# Altium project Battery Profiler.PrjPcb
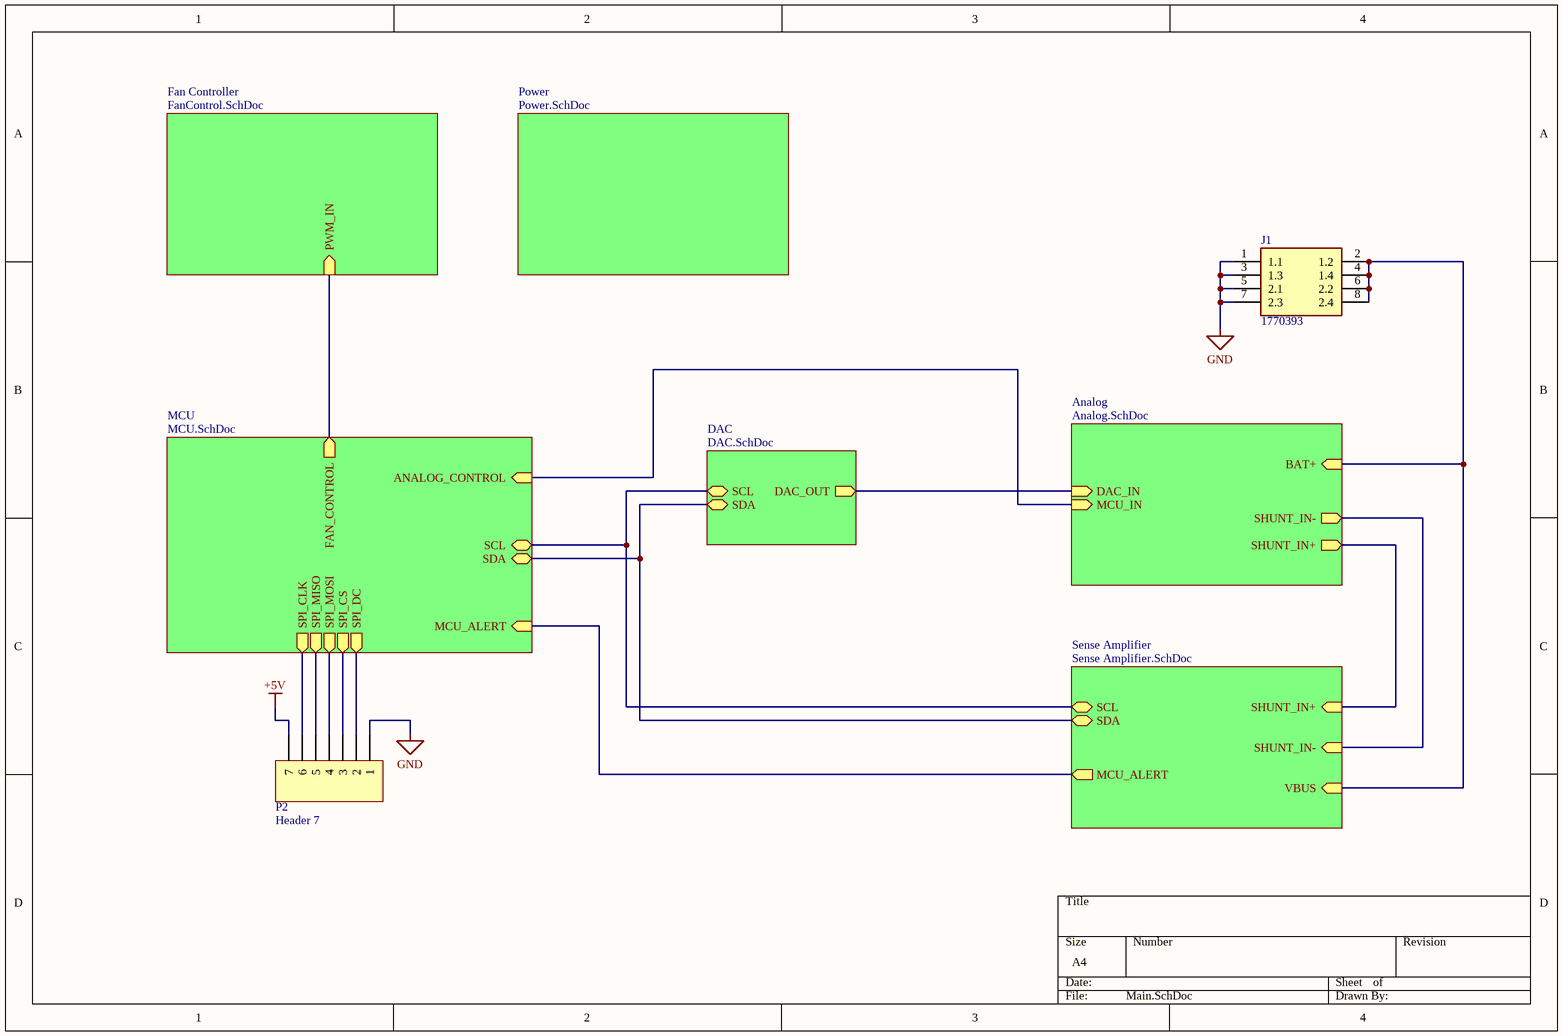
[diagram p0: Main.SchDoc]
7 sheets, 74 parts. Net scope: hierarchical (ports join the sheet entries above them; power ports are global).
Board file: PCB1.PcbDoc
Sheets:
  Main.SchDoc
    Analog = Analog.SchDoc
    MCU = MCU.SchDoc
    DAC = DAC.SchDoc
    Fan Controller = FanControl.SchDoc
    Power = Power.SchDoc
    Sense Amplifier = Sense Amplifier.SchDoc

## Sheet Main.SchDoc
size A4; SheetNumber: 1; SheetTotal: 7

### Parts
J1  1770393  [1770393]
P2  Header 7  [HDR1X7]

### Sub-sheets
Analog = Analog.SchDoc: DAC_IN (in), BAT+ (in), MCU_IN (in), SHUNT_IN+ (out), SHUNT_IN- (out)
DAC = DAC.SchDoc: DAC_OUT (out), SCL (bidir), SDA (bidir)
Fan Controller = FanControl.SchDoc: PWM_IN (in)
MCU = MCU.SchDoc: SPI_CLK (out), SPI_MISO (out), SPI_MOSI (out), SPI_CS (out), SPI_DC (out), FAN_CONTROL (out), SCL (bidir), SDA (bidir), MCU_ALERT (in), ANALOG_CONTROL (in)
Power = Power.SchDoc: no entries
Sense Amplifier = Sense Amplifier.SchDoc: SHUNT_IN+ (in), SHUNT_IN- (in), SCL (bidir), SDA (bidir), MCU_ALERT (out), VBUS (in)

### Nets
+5V: P2.7
GND: J1.1(1.1) J1.3(1.3) J1.5(2.1) J1.7(2.3) P2.1 ; sheet Analog/SHUNT_IN-, sheet Sense Amplifier/SHUNT_IN-
NetIC1_5: sheet MCU/FAN_CONTROL, sheet Fan Controller/PWM_IN
NetJ1_2: J1.2(1.2) J1.4(1.4) J1.6(2.2) J1.8(2.4) ; sheet Analog/BAT+, sheet Sense Amplifier/VBUS
NetP2_2: P2.2 ; sheet MCU/SPI_DC
NetP2_3: P2.3 ; sheet MCU/SPI_CS
NetP2_4: P2.4 ; sheet MCU/SPI_MOSI
NetP2_5: P2.5 ; sheet MCU/SPI_MISO
NetP2_6: P2.6 ; sheet MCU/SPI_CLK
NetQ3_3: sheet Analog/SHUNT_IN+, sheet Sense Amplifier/SHUNT_IN+
NetR2_1: sheet Analog/DAC_IN, sheet DAC/DAC_OUT
NetR16_2: sheet Analog/MCU_IN, sheet MCU/ANALOG_CONTROL
NetR25_1: sheet MCU/MCU_ALERT, sheet Sense Amplifier/MCU_ALERT
NetU3_27: sheet MCU/SDA, sheet DAC/SDA, sheet Sense Amplifier/SDA
NetU3_28: sheet MCU/SCL, sheet DAC/SCL, sheet Sense Amplifier/SCL

### Library data of the parts
J1 = 1770393: Connector; Manufacturer_Name: Phoenix Contact; Datasheet Link: https://www.phoenixcontact.com/online/portal/us/pxc/product_detail_page/!ut/p/z1/3Vdbb9owFP4r9IFHYzsXJ5m0B6BoQCkLJawkL1HsGOQ1tyYBOn79HC7dQBs8VGhaoiPFds75zsX-rBzowTn0kmAtlkEp0iSI5Nz1iO90nF7PVgj-OtE7aHCvd3sj7Qn3xwr8Bj3olQGFLq5GkaB5kP-A7qrgSbWQiVB-MgykWmo1Tx; Height: 29.2mm; Manufacturer_Part_Number: 1770393; Mouser Part Number: 651-1770393; Mouser Price/Stock: https://www.mouser.co.uk/ProductDetail/Phoenix-Contact/1770393?qs=MfVUZiz0PxY16TK7qzndTA%3D%3D; Arrow Part Number: 1770393; Arrow Price/Stock: https://www.arrow.com/en/products/1770393/phoenix-contact
P2 = Header 7: Header, 7-Pin; LatestRevisionDate: 17-Jul-2002; LatestRevisionNote: Re-released for DXP Platform.; Publisher: Altium Limited

## Sheet Analog.SchDoc
size A4; SheetNumber: 2; SheetTotal: 7
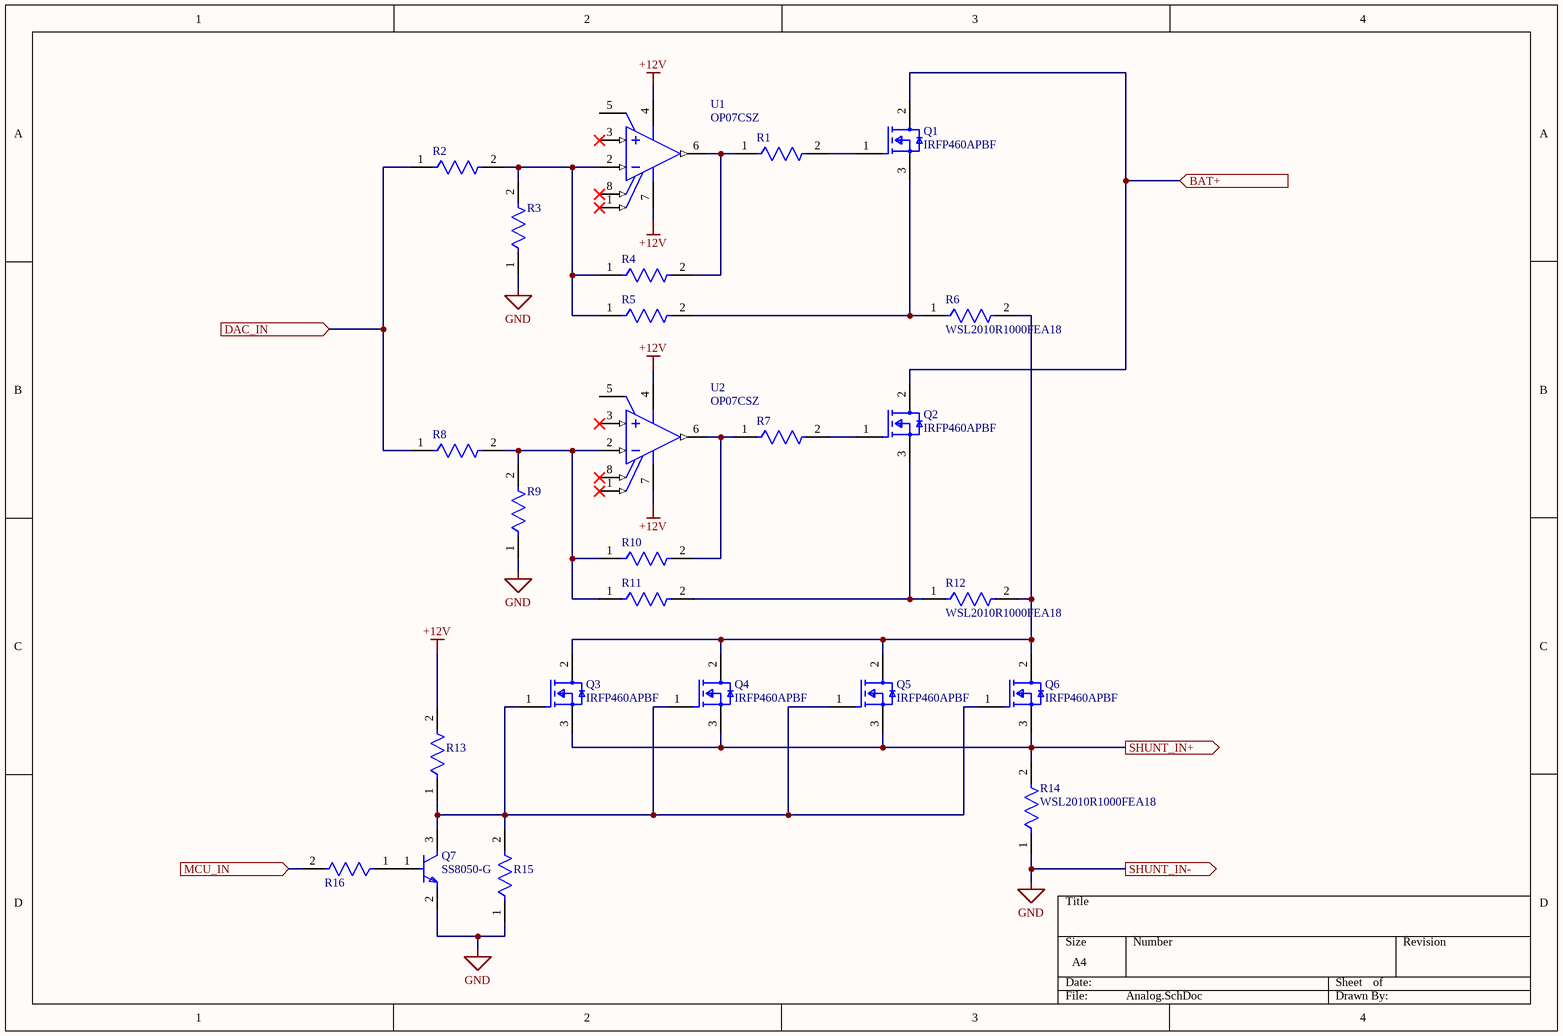
[diagram p1: Analog.SchDoc]

### Parts
Q1  IRFP460APBF  [FP-X13-0103-MFG]
Q2  IRFP460APBF  [FP-X13-0103-MFG]
Q3  IRFP460APBF  [FP-X13-0103-MFG]
Q4  IRFP460APBF  [FP-X13-0103-MFG]
Q5  IRFP460APBF  [FP-X13-0103-MFG]
Q6  IRFP460APBF  [FP-X13-0103-MFG]
Q7  SS8050-G  [FP-SS8050-G-MFG]
R1  ERJ-P06F1002V  [FP-ERJP06-MFG]  (value not drawn)
R2  ERJ-P06F1002V  [FP-ERJP06-MFG]  (value not drawn)
R3  ERJ-P06F1002V  [FP-ERJP06-MFG]  (value not drawn)
R4  ERJ-P06F1002V  [FP-ERJP06-MFG]  (value not drawn)
R5  ERJ-P06F1002V  [FP-ERJP06-MFG]  (value not drawn)
R6  WSL2010R1000FEA18  [FP-WSL2010-0_508-IPC_A]
R7  ERJ-P06F1002V  [FP-ERJP06-MFG]  (value not drawn)
R8  ERJ-P06F1002V  [FP-ERJP06-MFG]  (value not drawn)
R9  ERJ-P06F1002V  [FP-ERJP06-MFG]  (value not drawn)
R10  ERJ-P06F1002V  [FP-ERJP06-MFG]  (value not drawn)
R11  ERJ-P06F1002V  [FP-ERJP06-MFG]  (value not drawn)
R12  WSL2010R1000FEA18  [FP-WSL2010-0_508-IPC_A]
R13  ERJ-P06F1002V  [FP-ERJP06-MFG]  (value not drawn)
R14  WSL2010R1000FEA18  [FP-WSL2010-0_508-IPC_A]
R15  ERJ-P06F1002V  [FP-ERJP06-MFG]  (value not drawn)
R16  ERJ-P06F1002V  [FP-ERJP06-MFG]  (value not drawn)
U1  OP07CSZ  [ADI-R-8_M]
U2  OP07CSZ  [ADI-R-8_M]

### Ports
BAT+ (in, see Main[4B]), DAC_IN (in, see Main[3B]), MCU_IN (in, see Main[3B]), SHUNT_IN+ (out, see Main[4C], Sense Amplifier[1C]), SHUNT_IN- (out, see Main[4C], Sense Amplifier[1C])

### Nets
+12V: R13.2 U1.4(-V) U1.7(+V) U2.4(-V) U2.7(+V)
GND: Q7.2(E) R3.1 R9.1 R14.1 R15.1 ; port SHUNT_IN-
NetJ1_2: Q1.2(D) Q2.2(D) ; port BAT+
NetQ1_1: Q1.1(G) R1.2
NetQ1_3: Q1.3(S) R5.2 R6.1
NetQ2_1: Q2.1(G) R7.2
NetQ2_3: Q2.3(S) R11.2 R12.1
NetQ3_1: Q3.1(G) Q4.1(G) Q5.1(G) Q6.1(G) Q7.3(C) R13.1 R15.2
NetQ3_2: Q3.2(D) Q4.2(D) Q5.2(D) Q6.2(D) R6.2 R12.2
NetQ3_3: Q3.3(S) Q4.3(S) Q5.3(S) Q6.3(S) R14.2 ; port SHUNT_IN+
NetQ7_1: Q7.1(B) R16.1
NetR1_1: R1.1 R4.2 U1.6(OUT)
NetR2_1: R2.1 R8.1 ; port DAC_IN
NetR2_2: R2.2 R3.2 R4.1 R5.1 U1.2(-IN)
NetR7_1: R7.1 R10.2 U2.6(OUT)
NetR8_2: R8.2 R9.2 R10.1 R11.1 U2.2(-IN)
NetR16_2: R16.2 ; port MCU_IN

Not connected (* = marked no-connect by the designer): U1 1(VOS_TRIM)* 3(+IN)* 5(NC) 8(VOS_TRIM)*; U2 1(VOS_TRIM)* 3(+IN)* 5(NC) 8(VOS_TRIM)*

### Library data of the parts
Q1-Q6 = CMP-02550-000181-1: MOSFET N-CH 500V 20A TO-247AC; Manufacturer: Vishay; Max Junction Temp: +150°C; Depletion Mode: False; Number Of N Channels: 1; Drain To Source Resistance: 0.27Ω; Input Capacitace At Vds: 3100pF @ 25V; Pulse Drain Current: 80A; Turn Off Delay Time: 45ns; Reverse Recovery Charge: 5000nC; Turn On Delay Time: 18ns; Reverse Recovery Time: 480ns; Gate Charge At Vgs: 105nC @ 10V; Rthja Max: 40°C/W; Threshold Vgs Max: 4V; Max Forward Diode Voltage: 1.8V; Standoff Height: 3.71mm; Gate To Source Voltage: 30V; Power Dissipation: 280W; Threshold Vgs Min: 2V; RoHS: TRUE; Package: X13-0103; Temperature: -55°C to +150°C; ComponentLink2Description: Datasheet; Device Class L1: Discrete Semiconductors; Temperature Range High: +150°C; ComponentLink2URL: http://www.vishay.com/docs/91234/sihfp460.pdf; Height: 25.11mm; Manufacturer Part Number: IRFP460APBF; Automotive: No; Device Class L2: Transistors; Continuous Drain Current: 20A; Octopart: https://octopart.com/irfp460apbf-vishay-46526673; Temperature Range Low: -55°C; Number Of Channels: 1; Drain To Source Breakdown Voltage: 500V; Mouser Description: MOSFET N-Chan 500V 20 Amp; Category: Trans; Drain To Source Voltage: 500V; Lead Free: Yes; Device Class L3: MOSFETs; Digikey Description: MOSFET N-CH 500V 20A TO-247AC
Q7 = CMP-20235-000001-1: NPN TRANSISTOR 1.5A 40V SOT-23 R; Transition Frequency: 100MHz; Max Breakdown Voltage: 25V; Collector Emitter Voltage (VCEO): 400mV; Max Power Dissipation: 300mW; Max Collector Current: 1.5A; Case/Package: TO-236-3; Packaging: Tape and Reel; RoHS Compliant: Yes; Mount: Surface Mount; Collector Emitter Breakdown Voltage: 25V
R1-R5 R7-R11 R13 R15 R16 = CMP-05422-000126-1: RES SMD 10K OHM 1% 1/2W 0805; Temperature Coefficient: 100ppm/°C; Resistance: 10kR; Voltage Rating (DC): 150V; Max Power Dissipation: 500mW; Termination: SMD/SMT; Tolerance: 1%; Width: 1.2mm; Case/Package: 0805; Number of Terminations: 2; Resistor Type: Thick Film; Radiation Hardening: No; Resistance Tolerance: 1%; Package Quantity: 5000; Max Operating Temperature: 155°C; RoHS Compliant: Yes; Mount: Surface Mount; Case Code (Imperial): 0805; Construction: Rectangular; Height: 0.6mm; Lead Free: Lead Free; Depth: 1.25mm; Packaging: Tape and Reel; REACH SVHC: No SVHC; Technology: THICK FILM; Features: Automotive AEC-Q200; Contact Plating: Tin; Voltage Rating: 150V; Military Standard: Not; Power Rating: 500mW; Case Code (Metric): 2012; Length: 2mm; Min Operating Temperature: -55°C; Series: ERJ
R6 R12 R14 = CMP-00030-39744249-1: WSL2010R1000FEA18 SMD Chip Resistor, 100 MOhm, ± 1%, 1 W, 2010 [5025 Metric], Metal Strip, High Power; Resistance: 100mΩ; Power Rating: 1W; Temperature Coefficient: 75ppm/°C; Packaging: Cut Tape; Schedule B: 8533210045, 8533210045; Contact Plating: Tin; Height: 635µm; Max Operating Temperature: 170°C; Lead Free: Lead Free; RoHS: Compliant; Width: 2.5mm; Composition: Metal Element, Metal Strip; Radiation Hardening: No; Termination: SMD/SMT; Depth: 2.54mm; Length: 5mm; Case Code (Imperial): 2010; Case Code (Metric): 5025; Case/Package: 2010; Weight: 38.895546mg; REACH SVHC: Unknown; NexarPartId: 39744249; Tolerance: 1%; Min Operating Temperature: -65°C; Number of Pins: 2
U1 U2 = CMP-0384-01158-1: Single Channel Low Noise Operational Amplifier, 600 KHz BW, 300 mV/us SR, Industrial, 8-pin SOIC (R-8), Tube; Manufacturer: Analog Devices; Generic Part Number: OP07; # OpAmps per Pkg: 1; V Span Max: 44V; V Span Min: 6V; Small Signal Bandwidth: 600KHz; PackageReference: R-8; Packing: Tube; ComponentLink3Description: Package Specification; PartNumber: OP07CSZ; Code_JEDEC: MS-012-AA; ComponentLink2Description: Datasheet; DatasheetVersion: Rev. G; ComponentLink3URL: http://www.analog.com/static/imported-files/packages/PKG_PDF/SOIC_Narrow%20(R)/R_8.pdf; ComponentLink2URL: http://www.analog.com/static/imported-files/data_sheets/OP07.pdf; Slew Rate: 300mV/us; PackageDescription: 8-Pin Standard Small Outline Package, Body 3.9 x 4.9 mm, Pitch 1.27 mm; ComponentLink1URL: http://www.analog.com/en/index.html; Mounting Technology: Surface Mount; ComponentLink1Description: Manufacturer URL; PackageVersion: 060506-A

## Sheet MCU.SchDoc
size A; SheetNumber: 4; SheetTotal: 7
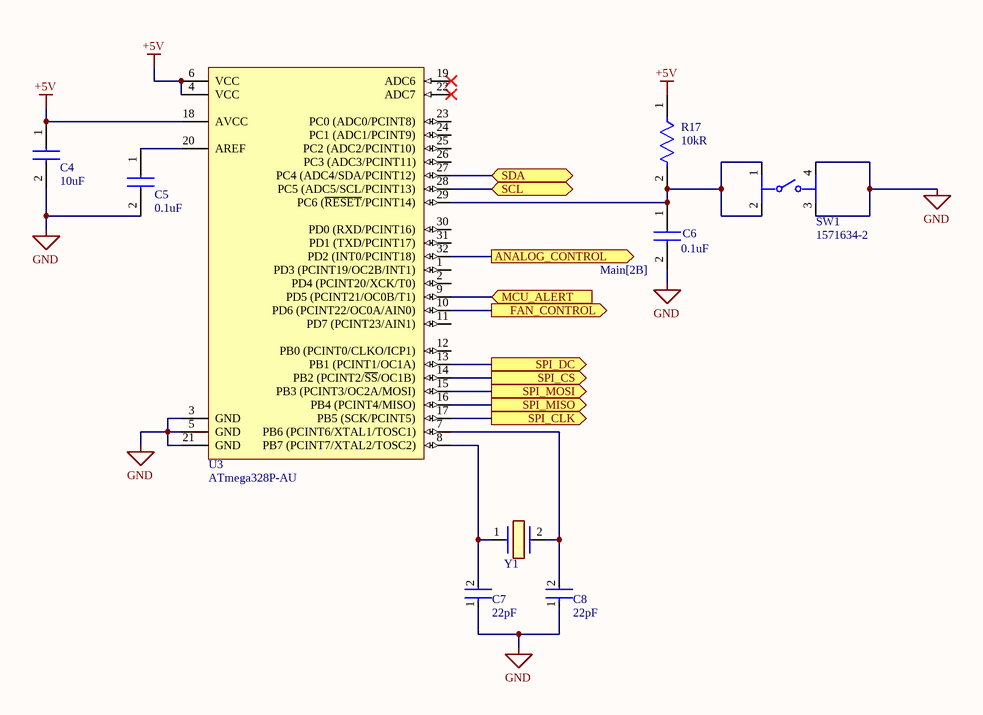
[diagram p2: MCU.SchDoc]

### Parts
C4  Capacitance: 10uF  [CAPC3216X180N]  (hidden comment: CL31A106MAHNNNE)
C5  Capacitance: 0.1uF  [CAPC3216X100N]  (hidden comment: CL31B104KBCNNNC)
C6  Capacitance: 0.1uF  [CAPC3216X100N]  (hidden comment: CL31B104KBCNNNC)
C7  Capacitance: 22pF  [FP-CL31-IPC_A]  (hidden comment: CL31C220JBCNNNC)
C8  Capacitance: 22pF  [FP-CL31-IPC_A]  (hidden comment: CL31C220JBCNNNC)
R17  Resistance: 10kR  [FP-RMCF1206-IPC_B]  (hidden comment: RMCF1206FT10K0)
SW1  1571634-2  [FP-1571634-2-MFG]
U3  ATmega328P-AU  [32A_M]
Y1  ECS-160-20-3X-TR  [ECS160203XTR]  (value not drawn)

### Ports
ANALOG_CONTROL (out, see Main[2B]), FAN_CONTROL (out, see Main[1B]), MCU_ALERT (in, see Main[2C], Sense Amplifier[4C]), SCL (bidir, see Main[2C], DAC[2B], Sense Amplifier[3B]), SDA (bidir, see Main[2C], DAC[2B], Sense Amplifier[3B]), SPI_CLK (out, see Main[1C]), SPI_CS (out, see Main[1C]), SPI_DC (out, see Main[1C]), SPI_MISO (out, see Main[1C]), SPI_MOSI (out, see Main[1C])

### Nets
+5V: C4.1 R17.1 U3.4(VCC) U3.6(VCC) U3.18(AVCC)
GND: C4.2 C5.2 C6.2 C7.1 C8.1 SW1.3 SW1.4 U3.3(GND) U3.5(GND) U3.21(GND)
NetC5_1: C5.1 U3.20(AREF)
NetC6_1: C6.1 R17.2 SW1.1 SW1.2 U3.29(PC6_(~{RESET}/PCINT14))
NetC7_2: C7.2 U3.8(PB7_(PCINT7/XTAL2/TOSC2)) Y1.1(X1)
NetC8_2: C8.2 U3.7(PB6_(PCINT6/XTAL1/TOSC1)) Y1.2(X2)
NetIC1_5: U3.10(PD6_(PCINT22/OC0A/AIN0)) ; port FAN_CONTROL
NetP2_2: U3.13(PB1_(PCINT1/OC1A)) ; port SPI_DC
NetP2_3: U3.14(PB2_(PCINT2/~{SS}/OC1B)) ; port SPI_CS
NetP2_4: U3.15(PB3_(PCINT3/OC2A/MOSI)) ; port SPI_MOSI
NetP2_5: U3.16(PB4_(PCINT4/MISO)) ; port SPI_MISO
NetP2_6: U3.17(PB5_(SCK/PCINT5)) ; port SPI_CLK
NetR16_2: U3.32(PD2_(INT0/PCINT18)) ; port ANALOG_CONTROL
NetR25_1: U3.9(PD5_(PCINT21/OC0B/T1)) ; port MCU_ALERT
NetU3_27: U3.27(PC4_(ADC4/SDA/PCINT12)) ; port SDA
NetU3_28: U3.28(PC5_(ADC5/SCL/PCINT13)) ; port SCL

Not connected (* = marked no-connect by the designer): U3 1(PD3_(PCINT19/OC2B/INT1)) 2(PD4_(PCINT20/XCK/T0)) 11(PD7_(PCINT23/AIN1)) 12(PB0_(PCINT0/CLKO/ICP1)) 19(ADC6)* 22(ADC7)* 23(PC0_(ADC0/PCINT8)) 24(PC1_(ADC1/PCINT9)) 25(PC2_(ADC2/PCINT10)) 26(PC3_(ADC3/PCINT11)) 30(PD0_(RXD/PCINT16)) 31(PD1_(TXD/PCINT17))

### Library data of the parts
C4 = CL31A106MAHNNNE: CAP CER 10UF 25V X5R 1206 CL31A106MAHNNNE; Manufacturer_Name: SAMSUNG; Datasheet Link: https://www.arrow.com/en/products/cl31a106mahnnne/samsung-electro-mechanics; Height: 1.8mm; Manufacturer_Part_Number: CL31A106MAHNNNE; Mouser Part Number: 187-CL31A106MAHNNNE; Mouser Price/Stock: https://www.mouser.co.uk/ProductDetail/Samsung-Electro-Mechanics/CL31A106MAHNNNE?qs=9y2YoPkPyvYkOWbcUKSn%252BQ%3D%3D; Arrow Part Number: CL31A106MAHNNNE; Arrow Price/Stock: https://www.arrow.com/en/products/cl31a106mahnnne/samsung-electro-mechanics; Supplier 1: Digi-Key; Supplier Part Number 1: 1276-1181-1-ND
C5 C6 = CL31B104KBCNNNC: CAP CER 0.1UF 50V X7R 1206; Manufacturer_Name: SAMSUNG; Datasheet Link: https://datasheet.datasheetarchive.com/originals/distributors/Datasheets_SAMA/0fdb6a11e020a7299f4d0713dd2bd7ee.pdf; Height: 1mm; Mouser Part Number: 187-CL31B104KBCNNNC; Mouser Price/Stock: https://www.mouser.co.uk/ProductDetail/Samsung-Electro-Mechanics/CL31B104KBCNNNC?qs=349EhDEZ59oHABbyGq1iKA%3D%3D; Arrow Part Number: CL31B104KBCNNNC; Arrow Price/Stock: https://www.arrow.com/en/products/cl31b104kbcnnnc/samsung-electro-mechanics?region=nac; Supplier 1: Digi-Key; Supplier Part Number 1: 1276-1017-1-ND
  C5: Manufacturer_Part_Number 1: CL31B104KBCNNNC
  C6: Manufacturer_Part_Number: CL31B104KBCNNNC
C7 C8 = CMP-13271-001055-1: Cap Ceramic 22pF 50V C0G ±5% SMD 1206 +125°C Embossed T/R; Temperature Coefficient: 300ppm/°C; Packaging: Tape and Reel; Material: Ceramic; Package Quantity: 1; Thickness: 0.039inch; Voltage: 50V; Height: 0.85mm; Radiation Hardening: No; Mount: Surface Mount; Width: 0.063inch; Min Operating Temperature: -55°C; Max Operating Temperature: 125°C; Voltage Rating (DC): 50V; Voltage Rating: 50V; Case/Package: 1206; Case Code (Metric): 3216; Tolerance: 5%; Length: 3.2mm; Dielectric: C0G; Lead Free: Lead Free; Depth: 1.6mm; Case Code (Imperial): 1206
R17 = CMP-26527-000151-1: 10kΩ ±1% 0.25W 1206 Thick Film Chip Resistor AEC-Q200 compliant RMCF1206FT10K0; Temperature Coefficient: 100ppm/°C; Max Power Dissipation: 250mW; Packaging: Tape and Reel; Resistor Type: Thick Film; Number of Terminations: 2; Depth: 1.6mm; Military Standard: Not; Contact Plating: Tin; Radiation Hardening: No; Lead Free: Lead Free; Tolerance: 1%; Length: 3.2mm; Size Code: 1206; RoHS Compliant: Yes; Case/Package: 1206; Mount: Surface Mount; Features: Automotive AEC-Q200; Min Operating Temperature: -55°C; Series: RMCF; Case Code (Imperial): 1206; Construction: Rectangular; Max Operating Temperature: 155°C; Width: 0.063inch; Height: 0.028inch; Power Rating: 250mW; Case Code (Metric): 3216
SW1 = CMP-03407-000008-1: SWITCH TACTILE SPST-NO 0.05A 24V; Actuator Length: 0.094inch; Max Current Rating: 50mA; Voltage Rating (DC): 12V; Actuator Material: Rubber; Switch Function: Off-Mom; Mechanical Life: 5000000Cycles; Actuator Type: Standard; Actuator Color: Natural; Illumination Type: Illuminated; Operating Force: 160gf; Throw Configuration: SPST; Package Quantity: 1000; Max Operating Temperature: 85°C; Mount: Surface Mount; Contact Plating: Silver; Depth: 10mm; Min Operating Temperature: -40°C; Radiation Hardening: No; ELV: Compliant; Case/Package: SMD/SMT; Length: 6.2mm; Termination: Gull Wing; Type: Switch; RoHS Compliant: Yes; Current Rating: 50mA; Contact Current Rating: 50mA; Orientation: Straight; Packaging: Tape and Reel; Max Voltage Rating (DC): 12V; Lead Free: Lead Free; Contact Material: Stainless Steel
U3 = CMP-0095-00269-2: 8-bit AVR Microcontroller, 32KB Flash, 1KB EEPROM, 2KB SRAM, 32-pin TQFP, Industrial Grade (-40°C to 85°C); PackageDescription: 32-Lead, 7x7x1.0 mm Body, 0.8mm Lead Pitch, Thin Profile Plastic Quad Flat Package (TQFP); DatasheetVersion: revD, May-2011; RevisionNote: DatasheetVersion & PackageVersion updated. URLs added.; ComponentLink1URL: http://www.atmel.com/; ComponentLink2Description: ATmega48A/48PA/88A/88PA/168A/168PA/328/328P Datasheet; Code_JEDEC: MS-026-ABA; ComponentLink1Description: Manufacturer URL; PackageReference: 32A; ComponentLink3Description: ATmega48A/48PA/88A/88PA/168A/168PA/328/328P Summary; ComponentLink2URL: http://www.atmel.com/dyn/resources/prod_documents/doc8271.pdf; PackageVersion: revC, Oct-2010; ComponentLink3URL: http://www.atmel.com/dyn/resources/prod_documents/8271S.pdf
Y1 = ECS-160-20-3X-TR: Crystal or Oscillator; Manufacturer_Name: ECS; Datasheet Link: https://www.arrow.com/en/products/ecs-160-20-3x-tr/ecs-international; Height: 2.3mm; Manufacturer_Part_Number: ECS-160-20-3X-TR; Mouser Part Number: 520-160-20-3XT; Mouser Price/Stock: https://www.mouser.co.uk/ProductDetail/ECS/ECS-160-20-3X-TR?qs=7Z%2FjUg96RbU1ElbRFXn8Rw%3D%3D; Arrow Part Number: ECS-160-20-3X-TR; Arrow Price/Stock: https://www.arrow.com/en/products/ecs-160-20-3x-tr/ecs-international?region=nac; Supplier 1: Digi-Key; Supplier Part Number 1: XC1776CT-ND

## Sheet DAC.SchDoc
size A4; SheetNumber: 6; SheetTotal: 7
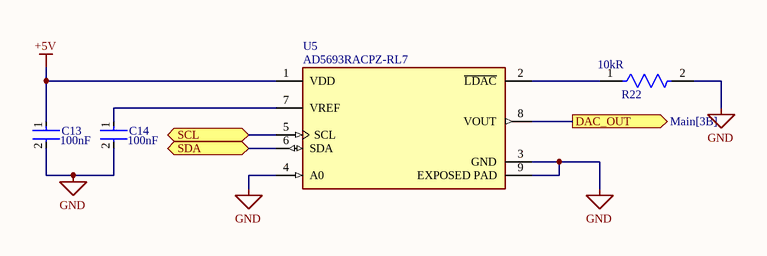
[diagram p3: DAC.SchDoc]

### Parts
C13  Capacitance: 100nF  [FP-C2012-125-0_45-MFG]  (hidden comment: C2012X7T2E104K125AE)
C14  Capacitance: 100nF  [FP-C2012-125-0_45-MFG]  (hidden comment: C2012X7T2E104K125AE)
R22  Resistance: 10kR  [FP-ERJP06-MFG]  (hidden comment: ERJ-P06F1002V)
U5  AD5693RACPZ-RL7  [FP-CP-8-10-IPC_C]

### Ports
DAC_OUT (out, see Main[3B]), SCL (bidir, see Main[2B], MCU[3B], Sense Amplifier[3B]), SDA (bidir, see Main[2B], MCU[3B], Sense Amplifier[3B])

### Nets
+5V: C13.1 U5.1(VDD)
GND: C13.2 C14.2 R22.2 U5.3(GND) U5.4(A0) U5.9(EXPOSED_PAD)
NetC14_1: C14.1 U5.7(VREF)
NetR2_1: U5.8(VOUT) ; port DAC_OUT
NetR22_1: R22.1 U5.2(~{LDAC})
NetU3_27: U5.6(SDA) ; port SDA
NetU3_28: U5.5(SCL) ; port SCL

### Library data of the parts
C13 C14 = CMP-08246-004341-1: CAP CER 0.1UF 250V X7T 0805; Tolerance: 10%; Case Code (Metric): 2012; Package Quantity: 1; Max Operating Temperature: 125°C; Thickness: 0.049inch; Case Code (Imperial): 0805; Features: Soft Termination; Length: 2mm; Weight: 0.000194oz; Min Operating Temperature: -55°C; Case/Package: 0805; Mount: Surface Mount; REACH SVHC: No SVHC; Dielectric: X7T; Voltage Rating: 250V; Width: 0.05inch; Series: C; Packaging: Tape and Reel; Depth: 1.25mm; Resistor Type: Ceramic; Voltage Rating (DC): 250V; Height: 1.25mm; Termination: SMD/SMT; RoHS Compliant: Yes
R22 = CMP-05422-000126-1: RES SMD 10K OHM 1% 1/2W 0805; Temperature Coefficient: 100ppm/°C; Voltage Rating (DC): 150V; Max Power Dissipation: 500mW; Termination: SMD/SMT; Tolerance: 1%; Width: 1.2mm; Case/Package: 0805; Number of Terminations: 2; Resistor Type: Thick Film; Radiation Hardening: No; Resistance Tolerance: 1%; Package Quantity: 5000; Max Operating Temperature: 155°C; RoHS Compliant: Yes; Mount: Surface Mount; Case Code (Imperial): 0805; Construction: Rectangular; Height: 0.6mm; Lead Free: Lead Free; Depth: 1.25mm; Packaging: Tape and Reel; REACH SVHC: No SVHC; Technology: THICK FILM; Features: Automotive AEC-Q200; Contact Plating: Tin; Voltage Rating: 150V; Military Standard: Not; Power Rating: 500mW; Case Code (Metric): 2012; Length: 2mm; Min Operating Temperature: -55°C; Series: ERJ
U5 = CMP-09082-000029-1: IC DAC 16BIT V-OUT 8LFCSP; Settling Time: 5us; Interface: I2C; Slew Rate: 0.7V/µs; Number of Bits: 16; Number of D/A Converters: 1; Min Output Voltage: 0uV; Integral Nonlinearity (INL): 8LSB; Signal to Noise Ratio (SNR): 90dB; Resolution: 16b; Min Supply Voltage: 2.7V; Max Input Voltage: 5.5V; Polarity: Unipolar; Differential Output: No; Output Type: Voltage; RoHS Compliant: Yes; Min Operating Temperature: -40°C; Max Operating Temperature: 105°C; Number of Pins: 8; Mount: Surface Mount; Lead Free: Contains Lead; Packaging: Tape and Reel; Number of DAC Channels: 1; Max Output Voltage: 5.5V; Max Supply Voltage: 5.5V

## Sheet FanControl.SchDoc
size A; SheetNumber: 3; SheetTotal: 7
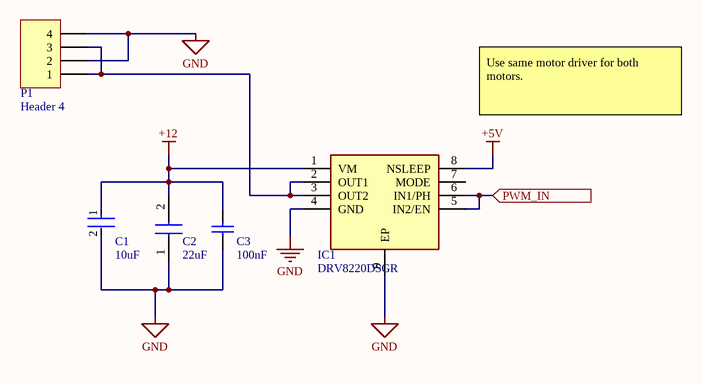
[diagram p4: FanControl.SchDoc]

### Parts
C1  Capacitance: 10uF  [FP-CL05A106MP5NUNC-MFG]  (hidden comment: CL05A106MP5NUNC)
C2  value 22uF  [CAPC1608X105N]  (hidden comment: CL10A226MP8NUNE)
C3  Capacitance: 100nF  [CAPC1050X55X23ML05T13]  (hidden comment: CL05B104KO5NNNC)
IC1  DRV8220DSGR  [SON50P200X200X80-9N]
P1  Header 4  [HDR1X4]

### Ports
PWM_IN (in, see Main[1B])

### Nets
+5V: IC1.8(NSLEEP)
+12: C1.1 C2.2 C3.2 IC1.1(VM)
GND: C1.2 C2.1 C3.1 IC1.4(GND) IC1.9(EP) P1.2 P1.4
NetIC1_2: IC1.2(OUT1) IC1.3(OUT2) P1.1 P1.3
NetIC1_5: IC1.5(IN2/EN) IC1.6(IN1/PH) ; port PWM_IN

Not connected (* = marked no-connect by the designer): IC1 7(MODE)

### Notes on the sheet
- Use same motor driver for both motors.

### Library data of the parts
C1 = CMP-13271-000002-1: CAP CER 10UF 10V X5R 0402; Manufacturer: Samsung; Temperature Coefficient: 15%; Tolerance: 20%; Material: Ceramic; Octopart: https://octopart.com/cl05a106mp5nunc-samsung-22457395; Voltage Rating: 10V; RoHS: TRUE; Value: 10uF; Height: 0.7mm; Digikey Description: CAP CER 10UF 10V X5R 0402; Automotive: No; Package: CL05A106MP5NUNC; Device Class L1: Passive Components; Temperature Range High: +85°C; ComponentLink2Description: Datasheet; Device Class L2: Capacitors; Temperature Characteristic: X5R; Manufacturer Part Number: CL05A106MP5NUNC; Temperature: -55°C to +85°C; ComponentLink2URL: http://www.samsungsem.com/kr/support/product-search/mlcc/__icsFiles/afieldfile/2019/05/10/19-CL05A106MP5NUNC.pdf; Device Class L3: Ceramic Capacitors; Category: Cap; Temperature Range Low: -55°C; Ipc Land Pattern Name: CAPC10050X50; Lead Free: Yes
C2 = CL10A226MP8NUNE: Capacitor; Manufacturer_Name: SAMSUNG; Datasheet Link: https://datasheet.datasheetarchive.com/originals/distributors/Datasheets-DGA10/2407063.pdf; Height: 1.05mm; Manufacturer_Part_Number: CL10A226MP8NUNE; Mouser Part Number: 187-CL10A226MP8NUNE; Mouser Price/Stock: https://www.mouser.co.uk/ProductDetail/Samsung-Electro-Mechanics/CL10A226MP8NUNE?qs=gRKWieUq2Hb5O0PTfRKzDQ%3D%3D; Arrow Part Number: CL10A226MP8NUNE; Arrow Price/Stock: https://www.arrow.com/en/products/cl10a226mp8nune/samsung-electro-mechanics?region=nac
C3 = CMP-2000-05439-1: Chip Capacitor, 100 nF, +/- 10%, 16 V, -55 to 125 degC, 0402 (1005 Metric), RoHS, Tape and Reel; Manufacturer: Samsung Electro-Mechanics; Dielectric: X7R; Rated Voltage: 16V; Case Size/Dimension: 0402; Tolerance (%): ±10%; Manufacturer URL: http://www.samsungsem.com/global/index.jsp; Datasheet URL: https://datasheet.ciiva.com/29198/458718-da-01-en-vs-kondensator-0402-29198423.pdf; Datasheet Version: Nov-10
IC1 = DRV8220DSGR: Integrated Circuit; Manufacturer_Name: Texas Instruments; Datasheet Link: https://www.ti.com/lit/gpn/drv8220; Height: 0.8mm; Manufacturer_Part_Number: DRV8220DSGR; Mouser Part Number: 595-DRV8220DSGR; Mouser Price/Stock: https://www.mouser.co.uk/ProductDetail/Texas-Instruments/DRV8220DSGR?qs=A6eO%252BMLsxmR1BpX9iMystg%3D%3D; Arrow Part Number: DRV8220DSGR; Arrow Price/Stock: https://www.arrow.com/en/products/drv8220dsgr/texas-instruments?region=nac
P1 = Header 4: Header, 4-Pin; LatestRevisionDate: 17-Jul-2002; LatestRevisionNote: Re-released for DXP Platform.; Publisher: Altium Limited

## Sheet Power.SchDoc
size A4; SheetNumber: 5; SheetTotal: 7
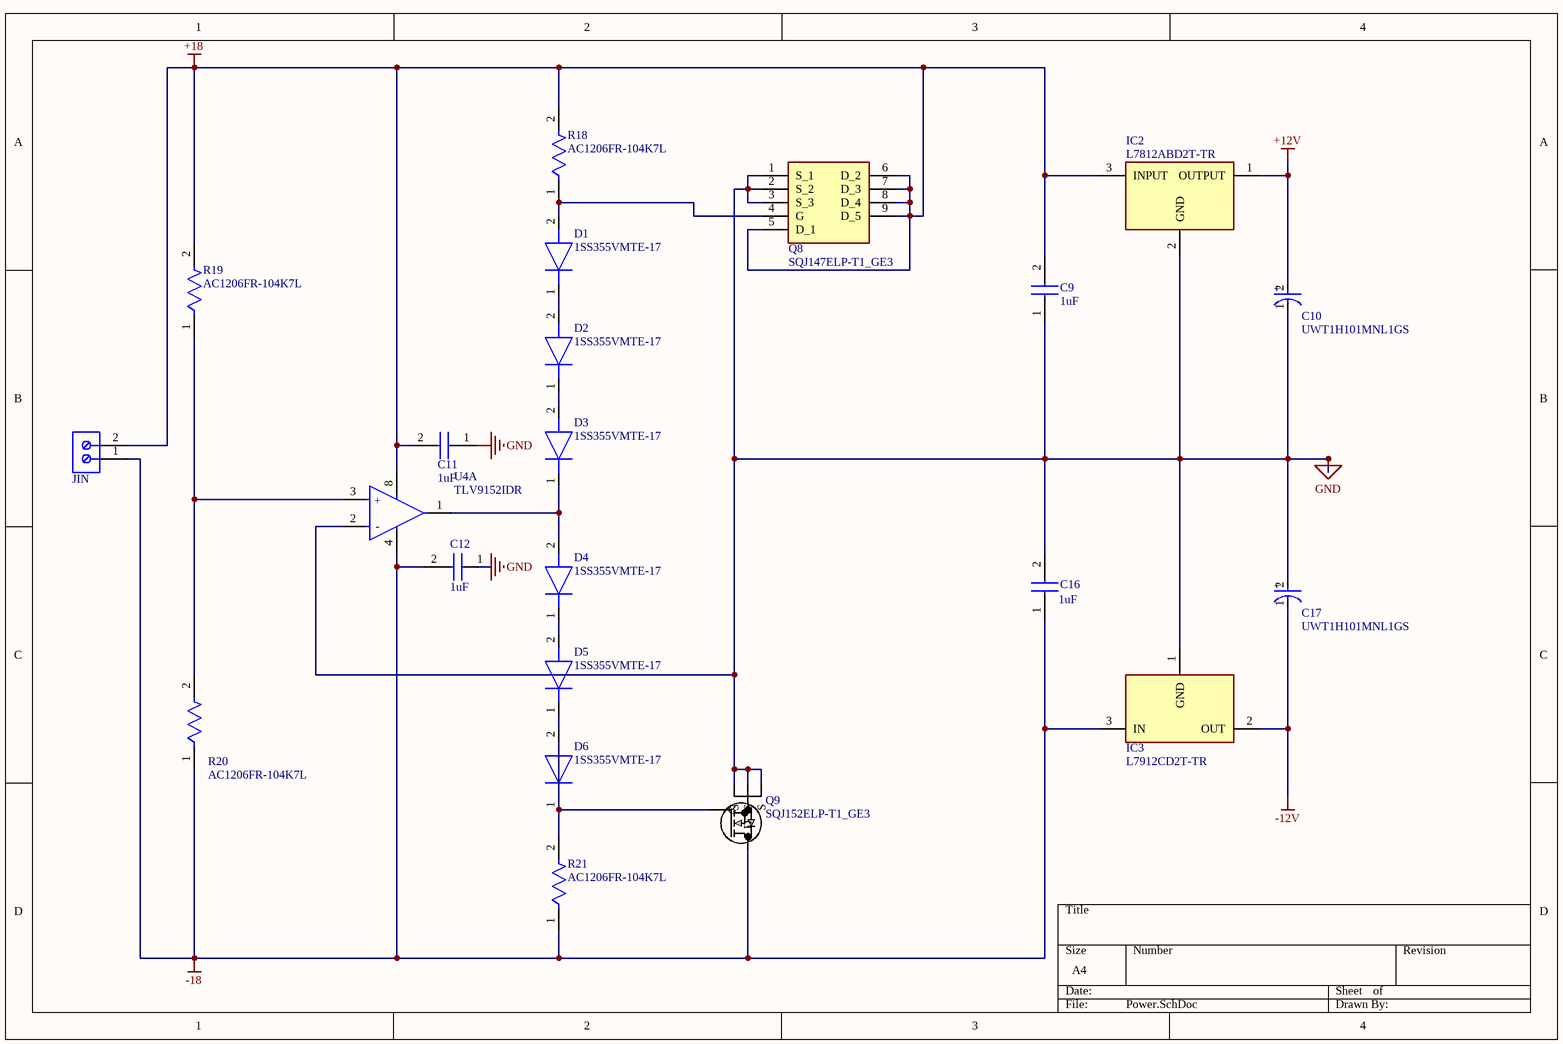
[diagram p5: Power.SchDoc]

### Parts
C9  1uF  [CAPC3216X178N]
C10  UWT1H101MNL1GS  [FP-UWT1H101MNL1GS-MFG]
C11  1uF  [CAPC3216X178N]
C12  1uF  [CAPC3216X178N]
C16  1uF  [CAPC3216X178N]
C17  UWT1H101MNL1GS  [FP-UWT1H101MNL1GS-MFG]
D1  1SS355VMTE-17  [UDZVTE1722B]
D2  1SS355VMTE-17  [UDZVTE1722B]
D3  1SS355VMTE-17  [UDZVTE1722B]
D4  1SS355VMTE-17  [UDZVTE1722B]
D5  1SS355VMTE-17  [UDZVTE1722B]
D6  1SS355VMTE-17  [UDZVTE1722B]
IC2  L7812ABD2T-TR  [L7812ABD2TTR]
IC3  L7912CD2T-TR  [L7905CD2TTR]
JIN  1714955  [PHOE-1714955_V]  (value not drawn)
Q8  SQJ147ELP-T1_GE3  [SQJ147ELPT1_GE3]
Q9  SQJ152ELP-T1_GE3  [DPAK5_ELP-T1_GE3_VIS]
R18  AC1206FR-104K7L  [FP-AC1206-MFG]
R19  AC1206FR-104K7L  [FP-AC1206-MFG]
R20  AC1206FR-104K7L  [FP-AC1206-MFG]
R21  AC1206FR-104K7L  [FP-AC1206-MFG]
U4  TLV9152IDR  [FP-D0008A-IPC_A]  (part A of 2)

### Nets
+12V: C10.2(A) IC2.1(OUTPUT)
+18: C9.2 C11.2 IC2.3(INPUT) JIN.2 Q8.5(D_1) Q8.6(D_2) Q8.7(D_3) Q8.8(D_4) Q8.9(D_5) R18.2 R19.2 U4.8(V+)
-12V: C17.1(C) IC3.2(OUT)
-18: C12.2 C16.1 IC3.3(IN) JIN.1 Q9.5(D) R20.1 R21.1 U4.4(V-)
GND: C9.1 C10.1(C) C11.1 C12.1 C16.2 C17.2(A) IC2.2(GND) IC3.1(GND) Q8.1(S_1) Q8.2(S_2) Q8.3(S_3) Q9.1(S) Q9.2(S) Q9.3(S) U4.2(IN1-)
NetD1_1: D1.1(K) D2.2(A)
NetD1_2: D1.2(A) Q8.4(G) R18.1
NetD2_1: D2.1(K) D3.2(A)
NetD3_1: D3.1(K) D4.2(A) U4.1(OUT1)
NetD4_1: D4.1(K) D5.2(A)
NetD5_1: D5.1(K) D6.2(A)
NetD6_1: D6.1(K) Q9.4(G) R21.2
NetR19_1: R19.1 R20.2 U4.3(IN1+)

### Notes on the sheet
- (in symbol CMP-2000-07373-2) +
- (in symbol CMP-04895-000148-1, part A) +; -

### Library data of the parts
C9 C11 C12 C16 = 12063C105MAT2A: Capacitor 12063C105MAT2A; Manufacturer_Name: AVX; Datasheet Link: https://spicat.kyocera-avx.com/product/mlcc/chartview/12063C105MAT2A/DataSheet/X7R; Height: 1.78mm; Manufacturer_Part_Number: 12063C105MAT2A; Mouser Part Number: 581-12063C105MAT2A; Mouser Price/Stock: https://www.mouser.com/Search/Refine.aspx?Keyword=581-12063C105MAT2A; Arrow Part Number: 12063C105MAT2A; Arrow Price/Stock: https://www.arrow.com/en/products/12063c105mat2a/avx
C10 C17 = CMP-2000-07373-2: CAP ALUM 100UF 20% 50V SMD; Leakage Current: 3uA; Ripple Current: 140mA; Life (Hours): 1000Hour; Dissipation Factor: 0.14%; Dielectric Material: Aluminium; Termination: SMD/SMT; Tolerance: 20%; Package Quantity: 500; Capacitance: 100uF; Height: 10mm; REACH SVHC: No SVHC; Case/Package: Radial; Series: WT; Diameter: 8mm; Voltage Rating: 50V; Construction: Cylindrical; Length: 10mm; Min Operating Temperature: -55°C; Max Operating Temperature: 105°C; Voltage Rating (DC): 50V; Packaging: Tape and Reel; Voltage: 50V; Mount: Surface Mount; Ripple Current (AC): 140mA; Radiation Hardening: No; Number of Pins: 2; Lead Free: Lead Free; Height - Seated (Max): 0.413inch; RoHS Compliant: Yes
D1-D6 = 1SS355VMTE-17: Diode; Manufacturer_Name: ROHM Semiconductor; Datasheet Link: https://datasheet.datasheetarchive.com/originals/distributors/Datasheets_SAMA/726503b2436a9ce4bc644e4966373f1b.pdf; Height: 0mm; Manufacturer_Part_Number: 1SS355VMTE-17; Mouser Part Number: 755-1SS355VMTE-17; Mouser Price/Stock: https://www.mouser.co.uk/ProductDetail/ROHM-Semiconductor/1SS355VMTE-17?qs=IsRgwgmxh693733hapxfjA%3D%3D
IC2 = L7812ABD2T-TR: Integrated Circuit; Manufacturer_Name: STMicroelectronics; Datasheet Link: https://componentsearchengine.com/Datasheets/1/L7812ABD2T-TR.pdf; Height: 4.7mm; Manufacturer_Part_Number: L7812ABD2T-TR; Mouser Part Number: 511-L7812ABD2T-TR; Mouser Price/Stock: https://www.mouser.co.uk/ProductDetail/STMicroelectronics/L7812ABD2T-TR?qs=llfGyK1OjE3hWetai%252BQcKg%3D%3D; Arrow Part Number: L7812ABD2T-TR; Arrow Price/Stock: https://www.arrow.com/en/products/l7812abd2t-tr/stmicroelectronics?region=europe
IC3 = L7912CD2T-TR: Integrated Circuit; Manufacturer_Name: STMicroelectronics; Datasheet Link: http://www.st.com/web/en/resource/technical/document/datasheet/CD00000450.pdf; Height: 4.6mm; Manufacturer_Part_Number: L7912CD2T-TR; Mouser Part Number: 511-L7912CD2T-TR; Mouser Price/Stock: https://www.mouser.co.uk/ProductDetail/STMicroelectronics/L7912CD2T-TR?qs=3sbPgdekz232r2AmOaAD%252Bg%3D%3D; Arrow Part Number: L7912CD2T-TR; Arrow Price/Stock: https://www.arrow.com/en/products/l7912cd2t-tr/stmicroelectronics?region=nac
JIN = CMP-2000-05797-1: PC Terminal Block, Pitch 6.35 mm, 1 x 2 Position, Height 21.5 mm, Tail Lenght 5.1 mm, RoHS, Bulk; Manufacturer: Phoenix Contact; Package Description: PC Terminal Block, Pitch 6.35 mm, 1 x 2 Position, Height 21.5 mm, Tail Lenght 5.1 mm; Datasheet URL: http://media.digikey.com/pdf/Data%20Sheets/Phoenix%20Contact%20PDFs/1714955.pdf; Package Reference: 1714955; Manufacturer URL: http://www.phoenixcontact.com/; Datasheet Version: 02/2010; Mounting Technology: ThroughHole
Q8 = SQJ147ELP-T1_GE3: MOSFET (N-Channel); Manufacturer_Name: Vishay; Datasheet Link: https://www.vishay.com/docs/77857/sqj147elp.pdf; Height: 1.227mm; Manufacturer_Part_Number: SQJ147ELP-T1_GE3; Mouser Part Number: 78-SQJ147ELP-T1_GE3; Mouser Price/Stock: https://www.mouser.co.uk/ProductDetail/Vishay-Siliconix/SQJ147ELP-T1_GE3?qs=81r%252BiQLm7BRdyhBg3DuaKw%3D%3D; Arrow Part Number: SQJ147ELP-T1_GE3; Arrow Price/Stock: https://www.arrow.com/en/products/sqj147elp-t1-ge3/vishay?region=nac
Q9 = SQJ152ELP-T1_GE3: No Description Available; Mfr_Name: Vishay; Type: DEV; Copyright: Copyright (C) 2023 Ultra Librarian. All rights reserved.; Manufacturer_Part_Number: SQJ152ELP-T1_GE3; RefDes: RefDes
R18-R21 = CMP-03412-035718-1: AC1206 4.7KΩ 0.25W 1.00%; Manufacturer: Yageo; Tolerance: 0.01; Automotive Grade: Grade 0; Voltage Rating: 200V; Lead Free: Yes; Composition: Thick Film; Category: Res; Device Class L2: Resistors; Device Class L1: Passive Components; Ipc Land Pattern Name: RESC310160X55; ComponentLink2URL: http://www.yageo.com/NewPortal/yageodocoutput?fileName=/pdf/R-Chip/PYu-AC_51_RoHS_L_6.pdf; Octopart: https://octopart.com/ac1206fr-104k7l-yageo-84718857; Package: AC1206; ComponentLink2Description: Datasheet; RoHS: TRUE; Resistance: 4.7KΩ; Value: 4.7KΩ; Temperature Range High: +155°C; Device Class L3: Chip SMD Resistors; Footprint Url: http://www.yageo.com/exep/pages/download/literatures/PYu-R_Mount_10.pdf; Temperature Range Low: -55°C; Manufacturer Part Number: AC1206FR-104K7L; Automotive: Yes; Height: 0.65mm; Series: AC; Power Rating: 0.25W; Temperature: -55°C to +155°C
U4 = CMP-04895-000148-1: IC OPAMP GP 2 CIRCUIT 8SOIC

## Sheet Sense Amplifier.SchDoc
size A4; SheetNumber: 7; SheetTotal: 7
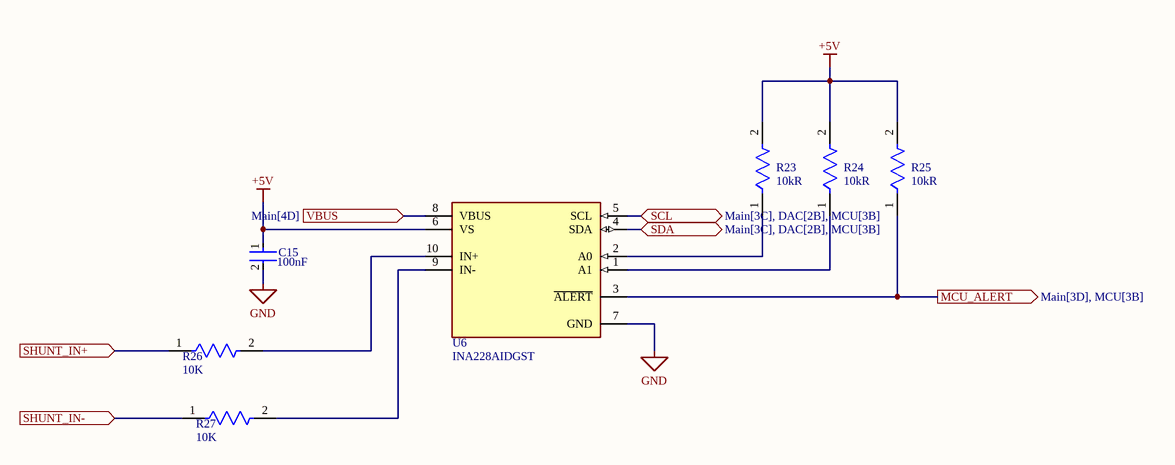
[diagram p6: Sense Amplifier.SchDoc]

### Parts
C15  Capacitance: 100nF  [FP-C2012-125-0_45-MFG]  (hidden comment: C2012X7T2E104K125AE)
R23  Resistance: 10kR  [FP-ERJP06-MFG]  (hidden comment: ERJ-P06F1002V)
R24  Resistance: 10kR  [FP-ERJP06-MFG]  (hidden comment: ERJ-P06F1002V)
R25  Resistance: 10kR  [FP-ERJP06-MFG]  (hidden comment: ERJ-P06F1002V)
R26  10K  [FP-ERJP06-MFG]
R27  10K  [FP-ERJP06-MFG]
U6  INA228AIDGST  [FP-DGS0010A-IPC_A]

### Ports
MCU_ALERT (out, see Main[3D], MCU[3B]), SCL (bidir, see Main[3C], DAC[2B], MCU[3B]), SDA (bidir, see Main[3C], DAC[2B], MCU[3B]), SHUNT_IN+ (in, see Main[4C], Analog[3C]), SHUNT_IN- (in, see Main[4C], Analog[3D]), VBUS (in, see Main[4D])

### Nets
+5V: C15.1 R23.2 R24.2 R25.2 U6.6(VS)
GND: C15.2 R27.1 U6.7(GND) ; port SHUNT_IN-
NetJ1_2: U6.8(VBUS) ; port VBUS
NetQ3_3: R26.1 ; port SHUNT_IN+
NetR23_1: R23.1 U6.2(A0)
NetR24_1: R24.1 U6.1(A1)
NetR25_1: R25.1 U6.3(~{ALERT}) ; port MCU_ALERT
NetR26_2: R26.2 U6.10(IN+)
NetR27_2: R27.2 U6.9(IN-)
NetU3_27: U6.4(SDA) ; port SDA
NetU3_28: U6.5(SCL) ; port SCL

### Library data of the parts
C15 = CMP-08246-004341-1: as C13 on sheet DAC; Case Code (Metric): 2012; Package Quantity: 1; Max Operating Temperature: 125°C; Thickness: 0.049inch; Case Code (Imperial): 0805; Features: Soft Termination; Length: 2mm; Weight: 0.000194oz; Min Operating Temperature: -55°C; Case/Package: 0805; Mount: Surface Mount; REACH SVHC: No SVHC; Dielectric: X7T; Voltage Rating: 250V; Width: 0.05inch; Series: C; Packaging: Tape and Reel; Depth: 1.25mm; Resistor Type: Ceramic; Voltage Rating (DC): 250V; Height: 1.25mm; Termination: SMD/SMT; RoHS Compliant: Yes
R23-R25 = CMP-05422-000126-1: as R22 on sheet DAC; Termination: SMD/SMT; Tolerance: 1%; Width: 1.2mm; Case/Package: 0805; Number of Terminations: 2; Resistor Type: Thick Film; Radiation Hardening: No; Resistance Tolerance: 1%; Package Quantity: 5000; Max Operating Temperature: 155°C; RoHS Compliant: Yes; Mount: Surface Mount; Case Code (Imperial): 0805; Construction: Rectangular; Height: 0.6mm; Lead Free: Lead Free; Depth: 1.25mm; Packaging: Tape and Reel; REACH SVHC: No SVHC; Technology: THICK FILM; Features: Automotive AEC-Q200; Contact Plating: Tin; Voltage Rating: 150V; Military Standard: Not; Power Rating: 500mW; Case Code (Metric): 2012; Length: 2mm; Min Operating Temperature: -55°C; Series: ERJ
R26 R27 = CMP-05422-000126-1: as R1 on sheet Analog; Termination: SMD/SMT; Tolerance: 1%; Width: 1.2mm; Case/Package: 0805; Number of Terminations: 2; Resistor Type: Thick Film; Radiation Hardening: No; Resistance Tolerance: 1%; Package Quantity: 5000; Max Operating Temperature: 155°C; RoHS Compliant: Yes; Mount: Surface Mount; Case Code (Imperial): 0805; Construction: Rectangular; Height: 0.6mm; Lead Free: Lead Free; Depth: 1.25mm; Packaging: Tape and Reel; REACH SVHC: No SVHC; Technology: THICK FILM; Features: Automotive AEC-Q200; Contact Plating: Tin; Voltage Rating: 150V; Military Standard: Not; Power Rating: 500mW; Case Code (Metric): 2012; Length: 2mm; Min Operating Temperature: -55°C; Series: ERJ
U6 = CMP-04895-000416-1: 85-V, 20-BIT, ULTRA-PRECISE, I2C

## Nets that join several sheets
+5V: Main (P2.7), MCU (5 pins), DAC (C13.1 U5.1), FanControl (IC1.8), Sense Amplifier (5 pins)
+12V: Analog (5 pins), Power (C10.2 IC2.1)
GND: Main (5 pins), Analog (5 pins), MCU (10 pins), DAC (6 pins), FanControl (7 pins), Power (15 pins), Sense Amplifier (C15.2 R27.1 U6.7)
NetIC1_5: MCU (U3.10), FanControl (IC1.5 IC1.6)
NetJ1_2: Main (J1.2 J1.4 J1.6 J1.8), Analog (Q1.2 Q2.2), Sense Amplifier (U6.8)
NetP2_2: Main (P2.2), MCU (U3.13)
NetP2_3: Main (P2.3), MCU (U3.14)
NetP2_4: Main (P2.4), MCU (U3.15)
NetP2_5: Main (P2.5), MCU (U3.16)
NetP2_6: Main (P2.6), MCU (U3.17)
NetQ3_3: Analog (5 pins), Sense Amplifier (R26.1)
NetR2_1: Analog (R2.1 R8.1), DAC (U5.8)
NetR16_2: Analog (R16.2), MCU (U3.32)
NetR25_1: MCU (U3.9), Sense Amplifier (R25.1 U6.3)
NetU3_27: MCU (U3.27), DAC (U5.6), Sense Amplifier (U6.4)
NetU3_28: MCU (U3.28), DAC (U5.5), Sense Amplifier (U6.5)